# EAGLE schematic SensorModule (EAGLE 8.1.1)
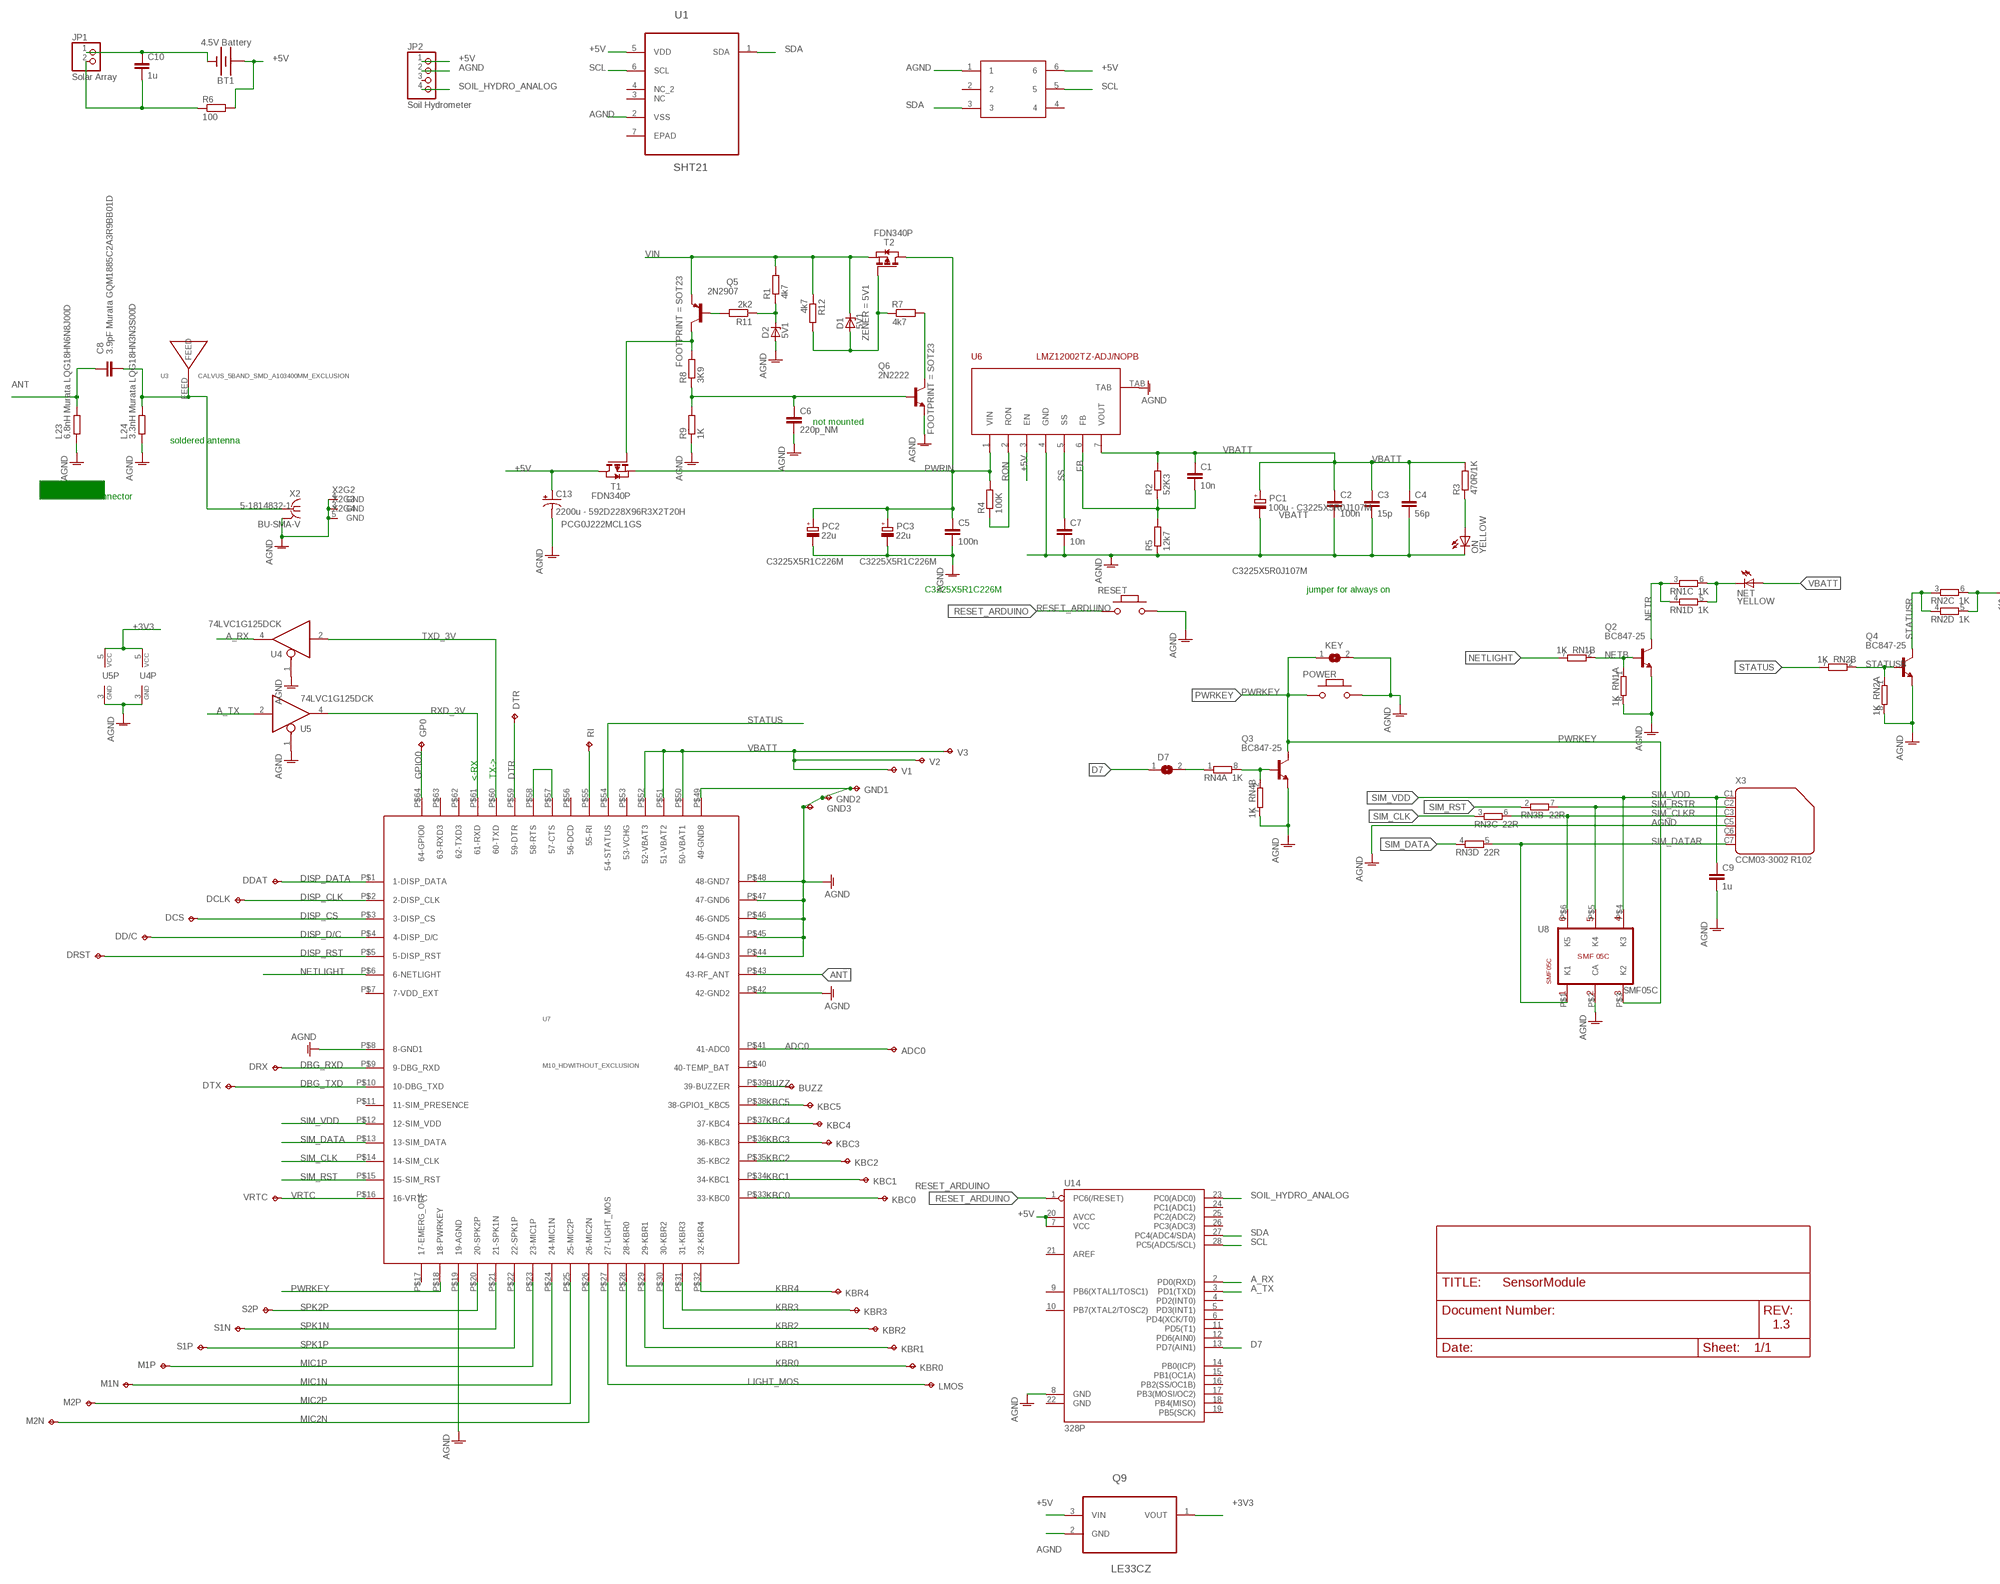
[diagram p0: schematic, sheet 1, part 1 of 2]
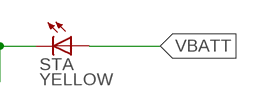
[diagram p1: schematic, sheet 1, part 2 of 2]

## Parts
ADC0  TPPAD1-09  [P1-09]
BT1  4.5V Battery  BATTERY-AA  [BATTERY-AA]
BUZZ  TPPAD1-09  [P1-09]
C1  10n  C-EU0603-RND  [C0603-ROUND]
C2  100n  C-EU0603-RND  [C0603-ROUND]
C3  15p  C-EU0603-RND  [C0603-ROUND]
C4  56p  C-EU0603-RND  [C0603-ROUND]
C5  100n  C-EU0603-RND  [C0603-ROUND]
C6  220p_NM  C-EU0603-RND  [C0603-ROUND]
C7  10n  C-EU0603-RND  [C0603-ROUND]
C8  3.9pF Murata GQM1885C2A3R9BB01D  C-EU0603-RND  [C0603-ROUND]
C9  1u  C-EU0603-RND  [C0603-ROUND]
C10  1u  C-EUC0201  [C0201]
C13  2200u - 592D228X96R3X2T20H  CPOL-US085CS-1AW  [085CS_1AW]
D1  5V1  ZENER-DIODESMB  [SMB]
D2  5V1  ZENER-DIODESMB  [SMB]
D7  SJ  [SJ]
DCLK  TPPAD1-09  [P1-09]
DCS  TPPAD1-09  [P1-09]
DD/C  TPPAD1-09  [P1-09]
DDAT  TPPAD1-09  [P1-09]
DRST  TPPAD1-09  [P1-09]
DRX  TPPAD1-09  [P1-09]
DTR  TPPAD1-09  [P1-09]
DTX  TPPAD1-09  [P1-09]
GND1  TPPAD1-09  [P1-09]
GND2  TPPAD1-09  [P1-09]
GND3  TPPAD1-09  [P1-09]
GP0  TPPAD1-09  [P1-09]
JP1  Solar Array  PINHD-1X2  [1X02]
JP2  Soil Hydrometer  PINHD-1X4  [1X04]
KBC0  TPPAD1-09  [P1-09]
KBC1  TPPAD1-09  [P1-09]
KBC2  TPPAD1-09  [P1-09]
KBC3  TPPAD1-09  [P1-09]
KBC4  TPPAD1-09  [P1-09]
KBC5  TPPAD1-09  [P1-09]
KBR0  TPPAD1-09  [P1-09]
KBR1  TPPAD1-09  [P1-09]
KBR2  TPPAD1-09  [P1-09]
KBR3  TPPAD1-09  [P1-09]
KBR4  TPPAD1-09  [P1-09]
KEY  SJ  [SJ]
L23  6.8nH Murata LQG18HN6N8J00D  R-EU_0603-RND  [R0603-ROUND]
L24  3.3nH Murata LQG18HN3N3S00D  R-EU_0603-RND  [R0603-ROUND]
LMOS  TPPAD1-09  [P1-09]
M1N  TPPAD1-09  [P1-09]
M1P  TPPAD1-09  [P1-09]
M2N  TPPAD1-09  [P1-09]
M2P  TPPAD1-09  [P1-09]
NET  YELLOW  LEDCHIP-LED0805  [CHIP-LED0805]
ON  YELLOW  LEDCHIP-LED0805  [CHIP-LED0805]
PC1  100u - C3225X5R0J107M  CPOL-EUSMCB  [SMC_B]
PC2  22u  CPOL-EUSMCB  [SMC_B]
PC3  22u  CPOL-EUSMCB  [SMC_B]
POWER  MYSMD_PB157  [SMD_157SW]
Q2  BC847-25  BC817-25SMD  [SOT23-BEC]
Q3  BC847-25  BC817-25SMD  [SOT23-BEC]
Q4  BC847-25  BC817-25SMD  [SOT23-BEC]
Q5  2N2907  MMBT2907ALT1-PNP-SOT23-BEC  [SOT23-BEC]
Q6  2N2222  MMBT2222ALT1-NPN-SOT23-BEC  [SOT23-BEC]
Q9  LE33CZ  [TO127P254X749-3]
R1  4k7  R-EU_0603-RND  [R0603-ROUND]
R2  52K3  R-EU_0603-RND  [R0603-ROUND]
R3  470R/1K  R-EU_0603-RND  [R0603-ROUND]
R4  100K  R-EU_0603-RND  [R0603-ROUND]
R5  12k7  R-EU_0603-RND  [R0603-ROUND]
R6  100  R-EU_R0201  [R0201]
R7  4k7  R-EU_0603-RND  [R0603-ROUND]
R8  3K9  R-EU_0603-RND  [R0603-ROUND]
R9  1K  R-EU_0603-RND  [R0603-ROUND]
R11  2k2  R-EU_0603-RND  [R0603-ROUND]
R12  4k7  R-EU_0603-RND  [R0603-ROUND]
RESET  MYSMD_PB157  [SMD_157SW]
RI  TPPAD1-09  [P1-09]
RN1  1K  4R-NCAY16  [CAY16]
RN2  1K  4R-NCAY16  [CAY16]
RN3  22R  4R-NCAY16  [CAY16]
RN4  1K  4R-NCAY16  [CAY16]
S1N  TPPAD1-09  [P1-09]
S1P  TPPAD1-09  [P1-09]
S2P  TPPAD1-09  [P1-09]
STA  YELLOW  LEDCHIP-LED0805  [CHIP-LED0805]
T1  FDN340P  PMOSSOT23  [SOT-23]
T2  FDN340P  PMOSSOT23  [SOT-23]
U1  SHT21  [DFN300X300X110-7N]
U3  CALVUS_5BAND_SMD_A103400MM_EXCLUSION  [CALVUS_5BAND_SMD_A10340_0MM_EXCLUSION]
U4  74LVC1G125DCK  [SC70-5]
U5  74LVC1G125DCK  [SC70-5]
U6  LMZ12002TZ-ADJ/NOPB  LMZ1200X  [TZA-7]
U7  M10_HDWITHOUT_EXCLUSION  [M10_HD_WITHOUT_EXCLUSION]
U8  SMF05C  [SC70_6L]
U14  328P  ATMEGA328P_PDIP  [DIP28]
U$1  VISHAY_VEML6070  [SOT-23-6]
V1  TPPAD1-09  [P1-09]
V2  TPPAD1-09  [P1-09]
V3  TPPAD1-09  [P1-09]
VRTC  TPPAD1-09  [P1-09]
X2  BU-SMA-V  [BU-SMA-V]
X3  CCM03-3002 R102  CON-AMPHENOL_SIMLOCK-C707_10M006_512_2  [CON-AMPHENOL_C707_10M006_512_2]

## Nets
+3V3: Q9.1(VOUT) U4.5(VCC) U5.5(VCC)
+5V: BT1.PWR@1(+) C13.+ JP2.1 Q9.3(VIN) R6.2 T1.1(D) U1.5(VDD) U6.3(EN) U14.7(VCC) U14.20(AVCC) U$1.6
A_RX: U4.4(O) U14.2(PD0(RXD))
A_TX: U5.2(I) U14.3(PD1(TXD))
ADC0: ADC0.TP U7.P$41(41-ADC0)
AGND: BT1.GND@1(-) C2.2 C3.2 C4.2 C5.2 C6.2 C7.2 C9.2 C10.1 C13.- D2.A GND1.TP GND2.TP GND3.TP JP1.1 JP2.2 KEY.2 L23.1 L24.1 ON.C PC1.- PC2.- PC3.- POWER.2 Q2.E Q3.E Q4.E Q6.E Q9.2(GND) R5.1 R9.1 RESET.2 RN1.8 RN2.8 RN4.7 U1.2(VSS) U4.1(OE) U4.3(GND) U5.1(OE) U5.3(GND) U6.4(GND) U6.TAB U7.P$8(8-GND1) U7.P$19(19-AGND) U7.P$42(42-GND2) U7.P$44(44-GND3) U7.P$45(45-GND4) U7.P$46(46-GND5) U7.P$47(47-GND6) U7.P$48(48-GND7) U7.P$49(49-GND8) U8.P$2(CA) U14.8(GND) U$1.1 X2.2(GND) X2.3(GND) X2.4(GND) X2.5(GND) X3.C5
ANT [antenna]: C8.1 L23.2 U7.P$43(43-RF_ANT)
ANTENA [antenna]: C8.2 L24.2 U3.FEED X2.1
BUZZ: BUZZ.TP U7.P$39(39-BUZZER)
D7: D7.1 U14.13(PD7(AIN1))
DBG_RXD: DRX.TP U7.P$9(9-DBG_RXD)
DBG_TXD: DTX.TP U7.P$10(10-DBG_TXD)
DISP_CLK: DCLK.TP U7.P$2(2-DISP_CLK)
DISP_CS: DCS.TP U7.P$3(3-DISP_CS)
DISP_D/C: DD/C.TP U7.P$4(4-DISP_D/C)
DISP_DATA: DDAT.TP U7.P$1(1-DISP_DATA)
DISP_RST: DRST.TP U7.P$5(5-DISP_RST)
DTR: DTR.TP U7.P$59(59-DTR)
FB: C1.2 R2.1 R5.2 U6.6(FB)
GPIO0: GP0.TP U7.P$64(64-GPIO0)
KBC0: KBC0.TP U7.P$33(33-KBC0)
KBC1: KBC1.TP U7.P$34(34-KBC1)
KBC2: KBC2.TP U7.P$35(35-KBC2)
KBC3: KBC3.TP U7.P$36(36-KBC3)
KBC4: KBC4.TP U7.P$37(37-KBC4)
KBC5: KBC5.TP U7.P$38(38-GPIO1_KBC5)
KBR0: KBR0.TP U7.P$28(28-KBR0)
KBR1: KBR1.TP U7.P$29(29-KBR1)
KBR2: KBR2.TP U7.P$30(30-KBR2)
KBR3: KBR3.TP U7.P$31(31-KBR3)
KBR4: KBR4.TP U7.P$32(32-KBR4)
LIGHT_MOS: LMOS.TP U7.P$27(27-LIGHT_MOS)
MIC1N: M1N.TP U7.P$24(24-MIC1N)
MIC1P: M1P.TP U7.P$23(23-MIC1P)
MIC2N: M2N.TP U7.P$26(26-MIC2N)
MIC2P: M2P.TP U7.P$25(25-MIC2P)
N$1: C10.2 JP1.2 R6.1
N$2: ON.A R3.1
N$4: Q3.B RN4.2 RN4.8
N$6: U7.P$57(57-CTS) U7.P$58(58-RTS)
N$7: D7.2 RN4.1
N$8: RI.TP U7.P$55(55-RI)
N$9: Q5.C R8.2 T1.3(G)
N$10: Q6.C R7.2
N$11: C6.1 Q6.B R8.1 R9.2
N$12: Q5.B R11.2
N$13: D1.A R7.1 R12.2 T2.3(G)
N$14: D2.C R1.1 R11.1
NETB: Q2.B RN1.1 RN1.2
NETL: NET.C RN1.5 RN1.6
NETLIGHT: RN1.7 U7.P$6(6-NETLIGHT)
NETR: Q2.C RN1.3 RN1.4
PWRIN: C5.1 PC2.+ PC3.+ R4.2 T1.2(S) T2.1(D) U6.1(VIN)
PWRKEY: KEY.1 POWER.1 Q3.C U7.P$18(18-PWRKEY) U8.P$3(K2)
RESET_ARDUINO: RESET.1 U14.1(PC6(/RESET))
RON: R4.1 U6.2(RON)
RXD_3V: U5.4(O) U7.P$61(61-RXD)
SCL: U1.6(SCL) U14.28(PC5(ADC5/SCL)) U$1.5
SDA: U1.1(SDA) U14.27(PC4(ADC4/SDA)) U$1.3
SIM_CLK: RN3.3 U7.P$14(14-SIM_CLK)
SIM_CLKR: RN3.6 U8.P$6(K5) X3.C3
SIM_DATA: RN3.4 U7.P$13(13-SIM_DATA)
SIM_DATAR: RN3.5 U8.P$1(K1) X3.C7
SIM_RST: RN3.2 U7.P$15(15-SIM_RST)
SIM_RSTR: RN3.7 U8.P$5(K4) X3.C2
SIM_VDD: C9.1 U7.P$12(12-SIM_VDD) U8.P$4(K3) X3.C1
SOIL_HYDRO_ANALOG: JP2.4 U14.23(PC0(ADC0))
SPK1N: S1N.TP U7.P$21(21-SPK1N)
SPK1P: S1P.TP U7.P$22(22-SPK1P)
SPK2P: S2P.TP U7.P$20(20-SPK2P)
SS: C7.1 U6.5(SS)
STATUS: RN2.7 U7.P$54(54-STATUS)
STATUSB: Q4.B RN2.1 RN2.2
STATUSL: RN2.5 RN2.6 STA.C
STATUSR: Q4.C RN2.3 RN2.4
TXD_3V: U4.2(I) U7.P$60(60-TXD)
VBATT: C1.1 C2.1 C3.1 C4.1 NET.A PC1.+ R2.2 R3.2 STA.A U6.7(VOUT) U7.P$50(50-VBAT1) U7.P$51(51-VBAT2) U7.P$52(52-VBAT3) V1.TP V2.TP V3.TP
VIN: D1.C Q5.E R1.2 R12.1 T2.2(S)
VRTC: U7.P$16(16-VRTC) VRTC.TP
Unconnected: JP2.3 RN3.1 RN3.8 RN4.3 RN4.4 RN4.5 RN4.6 U1.3(NC) U1.4(NC_2) U1.7(EPAD) U7.P$7(7-VDD_EXT) U7.P$11(11-SIM_PRESENCE) U7.P$17(17-EMERG_OFF) U7.P$40(40-TEMP_BAT) U7.P$53(53-VCHG) U7.P$56(56-DCD) U7.P$62(62-TXD3) U7.P$63(63-RXD3) U14.4(PD2(INT0)) U14.5(PD3(INT1)) U14.6(PD4(XCK/T0)) U14.9(PB6(XTAL1/TOSC1)) U14.10(PB7(XTAL2/TOSC2)) U14.11(PD5(T1)) U14.12(PD6(AIN0)) U14.14(PB0(ICP)) U14.15(PB1(OC1A)) U14.16(PB2(SS/OC1B)) U14.17(PB3(MOSI/OC2)) U14.18(PB4(MISO)) U14.19(PB5(SCK)) U14.21(AREF) U14.22(GND) U14.24(PC1(ADC1)) U14.25(PC2(ADC2)) U14.26(PC3(ADC3)) U$1.2 U$1.4 X3.C6

## Notes on the sheet
- not mounted
- soldered antenna
- SMA or U.FL connector
- PCG0J222MCL1GS
- C3225X5R1C226M | jumper for always on
- <-RX
- TX->
- SMF05C
- 1.3

## Library data of the parts
ADC0 BUZZ DCLK DCS DD/C DDAT DRST DRX DTR DTX GND1-GND3 GP0 KBC0 KBC1-KBC5 KBR0 KBR1-KBR4 LMOS M1N M1P M2N M2P RI S1N S1P S2P V1-V3 VRTC = testpad:TP: Test pad
BT1 = SparkFun-Batteries:BATTERY: Battery - Single Cell A variety of battery chemistries, sizes, and footprints. Device List: 20MM_PTH - Coin Cell Battery Holder - 20mm (PTH) <https://www.sparkfun.com/products/783> 12MM_SMD - Coin Cell Battery Holder - 12mm (SMD) <https://www.sparkfun.com/products/10592> 12MM_PTH - Coin Cell Battery Holder - 12mm (PTH) <https://www.sparkfun.com/products/7948> 20MM_SMD - 20mm Coin Cell Battery Holder (SMD) (2 legs) Used on the Big Time Watch Kit <https://www.sparkfun.com/products/11734> 20MM_SMD_4LEGS - Coin Cell Battery Holder - 20mm (SMD) <https://www.sparkfun.com/products/11892> 20MM_SMD_4LEGS_OVERPASTE - Coin Cell Battery Holder - 20mm (SMD) <https://www.sparkfun.com/products/11892> (Over-paste on the legs) 24.5MM_PTH - Coin Cell Battery Holder - 24.5mm (PTH) <https://www.sparkfun.com/products/8863> 9V - 9V Battery Holder - PC Mount Used on the SparkFun SparkPunk Sound Kit <https://www.sparkfun.com/products/11177> and SparkFun SparkPunk Sequencer Kit <https://www.sparkfun.com/products/12707> 18650 - Battery Holder - 18650 (PTH) <https://www.sparkfun.com/products/13113> AA - Battery Holder - 1xAA (PTH) <https://www.sparkfun.com/products/7949> AAA - Battery Holder - 1xAAA (PTH) <https://www.sparkfun.com/products/12718> AA_KIT - Battery Holder - 1xAA (PTH) <https://www.sparkfun.com/products/7949> Special kit package - pads only have exposed copper on one side of the board. AAA_KIT - Battery Holder - 1xAAA (PTH) <https://www.sparkfun.com/products/12718> Special kit package - pads only have exposed copper on one side of the board.; PROD_ID: BATT-08316; SF_SKU: PRT-07949
C1-C9 = SmartPrj:C-EU: CAPACITOR, European symbol
C10 = resistor:C-EU: CAPACITOR, European symbol
C13 = rcl:CPOL-US: POLARIZED CAPACITOR, American symbol
D1 = diode:ZENER-DIODE: Z-Diode; ZENER: 5V1
D2 = diode:ZENER-DIODE: Z-Diode
D7 KEY = jumper:SJ: SMD solder JUMPER
JP1 = pinhead:PINHD-1X2: PIN HEADER
JP2 = pinhead:PINHD-1X4: PIN HEADER
L23 L24 R1-R5 R7-R9 R11 R12 = SmartPrj:R-EU_: RESISTOR, European symbol
NET ON STA = led:LED: LED OSRAM: - CHIPLED LG R971, LG N971, LY N971, LG Q971, LY Q971, LO R971, LY R971 LH N974, LH R974 LS Q976, LO Q976, LY Q976 LO Q996 - Hyper CHIPLED LW Q18S LB Q993, LB Q99A, LB R99A - SideLED LS A670, LO A670, LY A670, LG A670, LP A670 LB A673, LV A673, LT A673, LW A673 LH A674 LY A675 LS A676, LA A676, LO A676, LY A676, LW A676 LS A679, LY A679, LG A679 - Hyper Micro SIDELED® LS Y876, LA Y876, LO Y876, LY Y876 LT Y87S - SmartLED LW L88C, LW L88S LB L89C, LB L89S, LG L890 LS L89K, LO L89K, LY L89K LS L896, LA L896, LO L896, LY L896 - TOPLED LS T670, LO T670, LY T670, LG T670, LP T670 LSG T670, LSP T670, LSY T670, LOP T670, LYG T670 LG T671, LOG T671, LSG T671 LB T673, LV T673, LT T673, LW T673 LH T674 LS T676, LA T676, LO T676, LY T676, LB T676, LH T676, LSB T676, LW T676 LB T67C, LV T67C, LT T67C, LS T67K, LO T67K, LY T67K, LW E67C LS E67B, LA E67B, LO E67B, LY E67B, LB E67C, LV E67C, LT E67C LW T67C LS T679, LY T679, LG T679 LS T770, LO T770, LY T770, LG T770, LP T770 LB T773, LV T773, LT T773, LW T773 LH T774 LS E675, LA E675, LY E675, LS T675 LS T776, LA T776, LO T776, LY T776, LB T776 LHGB T686 LT T68C, LB T68C - Hyper Mini TOPLED® LB M676 - Mini TOPLED Santana® LG M470 LS M47K, LO M47K, LY M47K Source: http://www.osram.convergy.de LUXEON: - LUMILED® LXK2-PW12-R00, LXK2-PW12-S00, LXK2-PW14-U00, LXK2-PW14-V00 LXK2-PM12-R00, LXK2-PM12-S00, LXK2-PM14-U00 LXK2-PE12-Q00, LXK2-PE12-R00, LXK2-PE12-S00, LXK2-PE14-T00, LXK2-PE14-U00 LXK2-PB12-K00, LXK2-PB12-L00, LXK2-PB12-M00, LXK2-PB14-N00, LXK2-PB14-P00, LXK2-PB14-Q00 LXK2-PR12-L00, LXK2-PR12-M00, LXK2-PR14-Q00, LXK2-PR14-R00 LXK2-PD12-Q00, LXK2-PD12-R00, LXK2-PD12-S00 LXK2-PH12-R00, LXK2-PH12-S00 LXK2-PL12-P00, LXK2-PL12-Q00, LXK2-PL12-R00 Source: www.luxeon.com KINGBRIGHT: KA-3528ASYC Source: www.kingbright.com
PC1 = rcl:CPOL-EU: POLARIZED CAPACITOR, European symbol; PN: C3225X5R0J107M
PC2 PC3 = rcl:CPOL-EU: POLARIZED CAPACITOR, European symbol; PN: C3225X5R1C226M
POWER RESET = SmartPrj:MYSMD_PB157
Q2-Q4 = transistor-npn:BC817*: NPN Transistor
Q5 = transistor-neu-to92:*-PNP-: PNP Transistror; FOOTPRINT: SOT23
Q6 = transistor-neu-to92:*-NPN-: NPN Transistror; FOOTPRINT: SOT23
Q9 = ST Microelctronics_By_element14_Batch_1:LE33CZ: VOLTAGE REGULATORS; MPN: LE33CZ; OC_FARNELL: 9755349; OC_NEWARK: 26M0166; PACKAGE: TO-92; SUPPLIER: STMICROELECTRONICS
R6 = resistor:R-EU_: RESISTOR, European symbol
RN1-RN4 = resistor-dil:4R-N: Array Chip Resistor Source: RS Component / Phycomp
T1 T2 = zetex:PMOSSOT23: MOS FET
U1 = Sensiron_HumiditySensor:SHT21: SENSOR, HUMIDITY & TEMP; MPN: SHT21; OC_FARNELL: 1855468; OC_NEWARK: 20T1172; PACKAGE: DFN-6; SUPPLIER: SENSIRION
U3 = SmartPrj:CALVUS_5BAND_SMD_A10340
U4 U5 = 74xx-little-us:74*1G125: Single Bus Buffer Gate with 3-State Output
U6 = SmartPrj:LMZ1200X
U7 = GSM:M10_HD
U8 = SmartPrj:SMF05C: SMF05C-TVS Diode Array For ESD and Latch-Up Protection
U14 = SparkFun-IC-Microcontroller:ATMEGA328P_PDIP: Atmel 328P Through hole ATMEGA328P uC used in the Arduino 32kb flash, 1k EEPROM, 2k SRAM Datasheet <http://www.sparkfun.com/datasheets/Components/SMD/ATMega328.pdf> SparkFun Products Storefront component: AVR 28 Pin 20MHz 32K 6A/D - ATMega328P <https://www.sparkfun.com/products/9061> (COM-09061) SparkFun Simon Says - Through-Hole Soldering Kit <https://www.sparkfun.com/products/10547> (KIT-10547) SparkFun Learn to Solder - Simon Says <https://www.sparkfun.com/products/13708> (KIT-13708) SparkFun BigTime Watch Kit <https://www.sparkfun.com/products/11734> (KIT-11734) SparkFun ClockIt <https://www.sparkfun.com/products/10930> (KIT-10930) SparkFun Serial Enabled LCD Kit <https://www.sparkfun.com/products/10097> (LCD-10097) SparkFun Simon Tilts - Through Hole Soldering Kit <https://www.sparkfun.com/products/12634> (KIT-12634) SparkFun Frequency Counter Kit <https://www.sparkfun.com/products/10140> (KIT-10140) FabFM Radio Kit <https://www.sparkfun.com/products/11043> (KIT-11043) SparkFun Binary Blaster Kit <https://www.sparkfun.com/products/12037> (KIT-12037) SparkFun Metro-Gnome <https://www.sparkfun.com/products/9236> (KIT-09236) ATmega328 with Arduino Optiboot (Uno) <https://www.sparkfun.com/products/10524> (DEV-10524); PROD_ID: IC-09136
U$1 = Vishay VEML6070:VISHAY_VEML6070
X2 = con-coax:BU-SMA-V: FEMALE SMA CONNECTOR Radiall distributor RS 112-3794; PN: 5-1814832-1
X3 = SmartPrj:CON-AMPHENOL_SIMLOCK-C707_10M006_512_2: C707A SIMLOCK® 2.5 mm with wide solder tails Source: Data sheet <http://www.amphenol.info/downloads/C707_10M006_512_2.pdf>; OC_FARNELL: 1463072; OC_NEWARK: unknown

## Net classes
4 antenna: clearance 0.61 mm